# Altium schematic sheet SimpleLDOConverter.SchDoc: Simple LDO Converter
size A4; DrawnBy: *Hakim Abtout; SheetNumber: 1; SheetTotal: 1
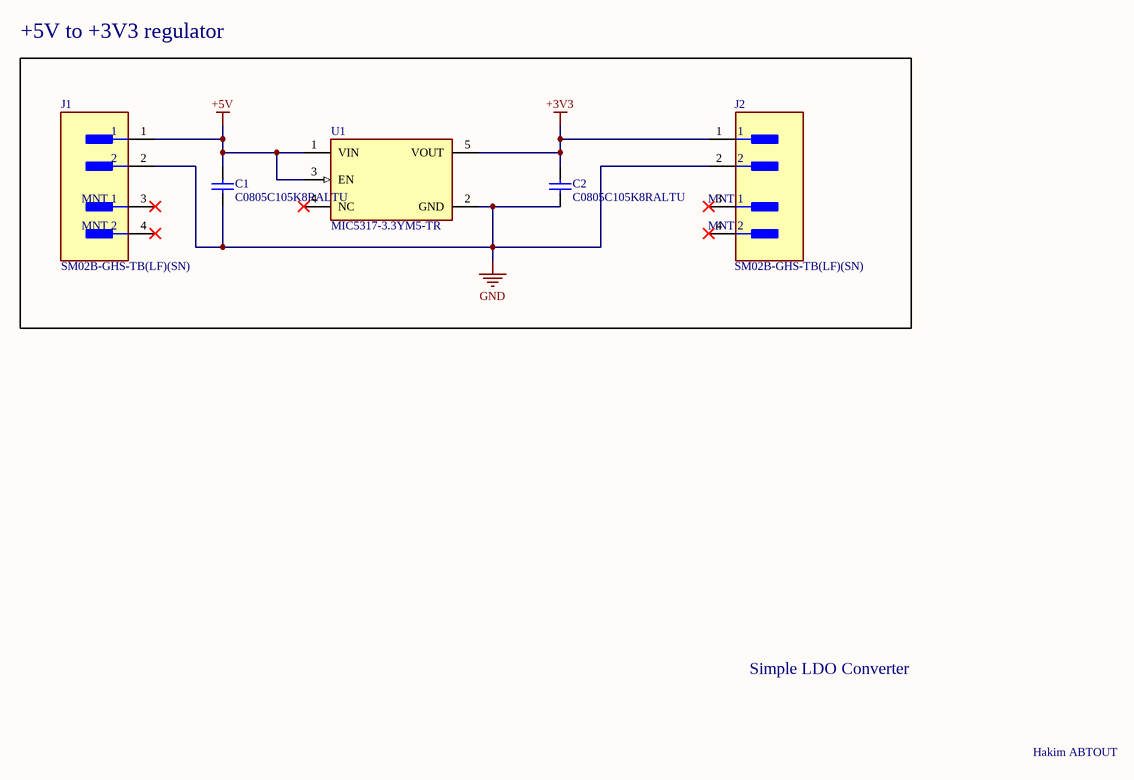
[diagram p0: SimpleLDOConverter.SchDoc]

## Parts
C1  C0805C105K8RALTU  [CAPC2013X145X50ML20T25]
C2  C0805C105K8RALTU  [CAPC2013X145X50ML20T25]
J1  SM02B-GHS-TB(LF)(SN)  [FP-SM02B-GHS-TB_LF_SN-MFG]
J2  SM02B-GHS-TB(LF)(SN)  [FP-SM02B-GHS-TB_LF_SN-MFG]
U1  MIC5317-3.3YM5-TR  [FP-SOT23-5LD-PL-1-MFG]

## Blocks framed on the sheet
+5V to +3V3 regulator: C1 C2 J1 J2 U1

## Nets
+3V3: C2.2 J2.1 U1.5(VOUT)
+5V: C1.2 J1.1 U1.1(VIN) U1.3(EN)
GND: C1.1 C2.1 J1.2 J2.2 U1.2(GND)

Not connected (* = marked no-connect by the designer): J1 3(MNT_1)* 4(MNT_2)*; J2 3(MNT_1)* 4(MNT_2)*; U1 4(NC)*

## Notes on the sheet
- Simple LDO Converter
- Hakim ABTOUT

## Library data of the parts
C1 C2 = CMP-2007-01152-1: Manufacturer: Kemet; Part Number: C0805C105K8RALTU
J1 J2 = CMP-2000-07076-2: CONN HEADER SMD R/A 2POS 1.25MM; Voltage Rating: 50V; Number of Positions: 2; Pitch: 0.049inch; Current Rating: 1A; Connector Type: Outer Shroud Contact; Number of Rows: 1; Contact Material: Bronze; Termination: Solder; Color: Natural; Package Quantity: 2500; Mount: Surface Mount; Housing Color: Natural; Number of Contacts: 2; Packaging: Tape and Reel; Lead Free: Lead Free; Housing Material: Nylon; Orientation: Right Angle; Contact Type: Male Pin; Contact Plating: Tin; Series: GH; Fastening Type: Latch
U1 = CMP-06324-000116-1: IC REG LINEAR 3.3V 150MA SOT23-5; Max Input Voltage: 6V; Number of Regulators: 1; Min Current Limit: 200mA; Dropout Voltage: 155mV; Min Input Voltage: 2.5V; Power Supply Rejection Ratio (PSRR): 70dB; Case/Package: SOT-23-5; Output Voltage: 3.3V; Series: -; Max Operating Temperature: 125°C; Package Quantity: 3000; Mount: Surface Mount; Packaging: Tape and Reel; RoHS Compliant: No; Output Current: 150mA; Min Operating Temperature: -40°C; Number of Outputs: 1